# EAGLE design growPi_v2.1 (EAGLE 8.6.0)
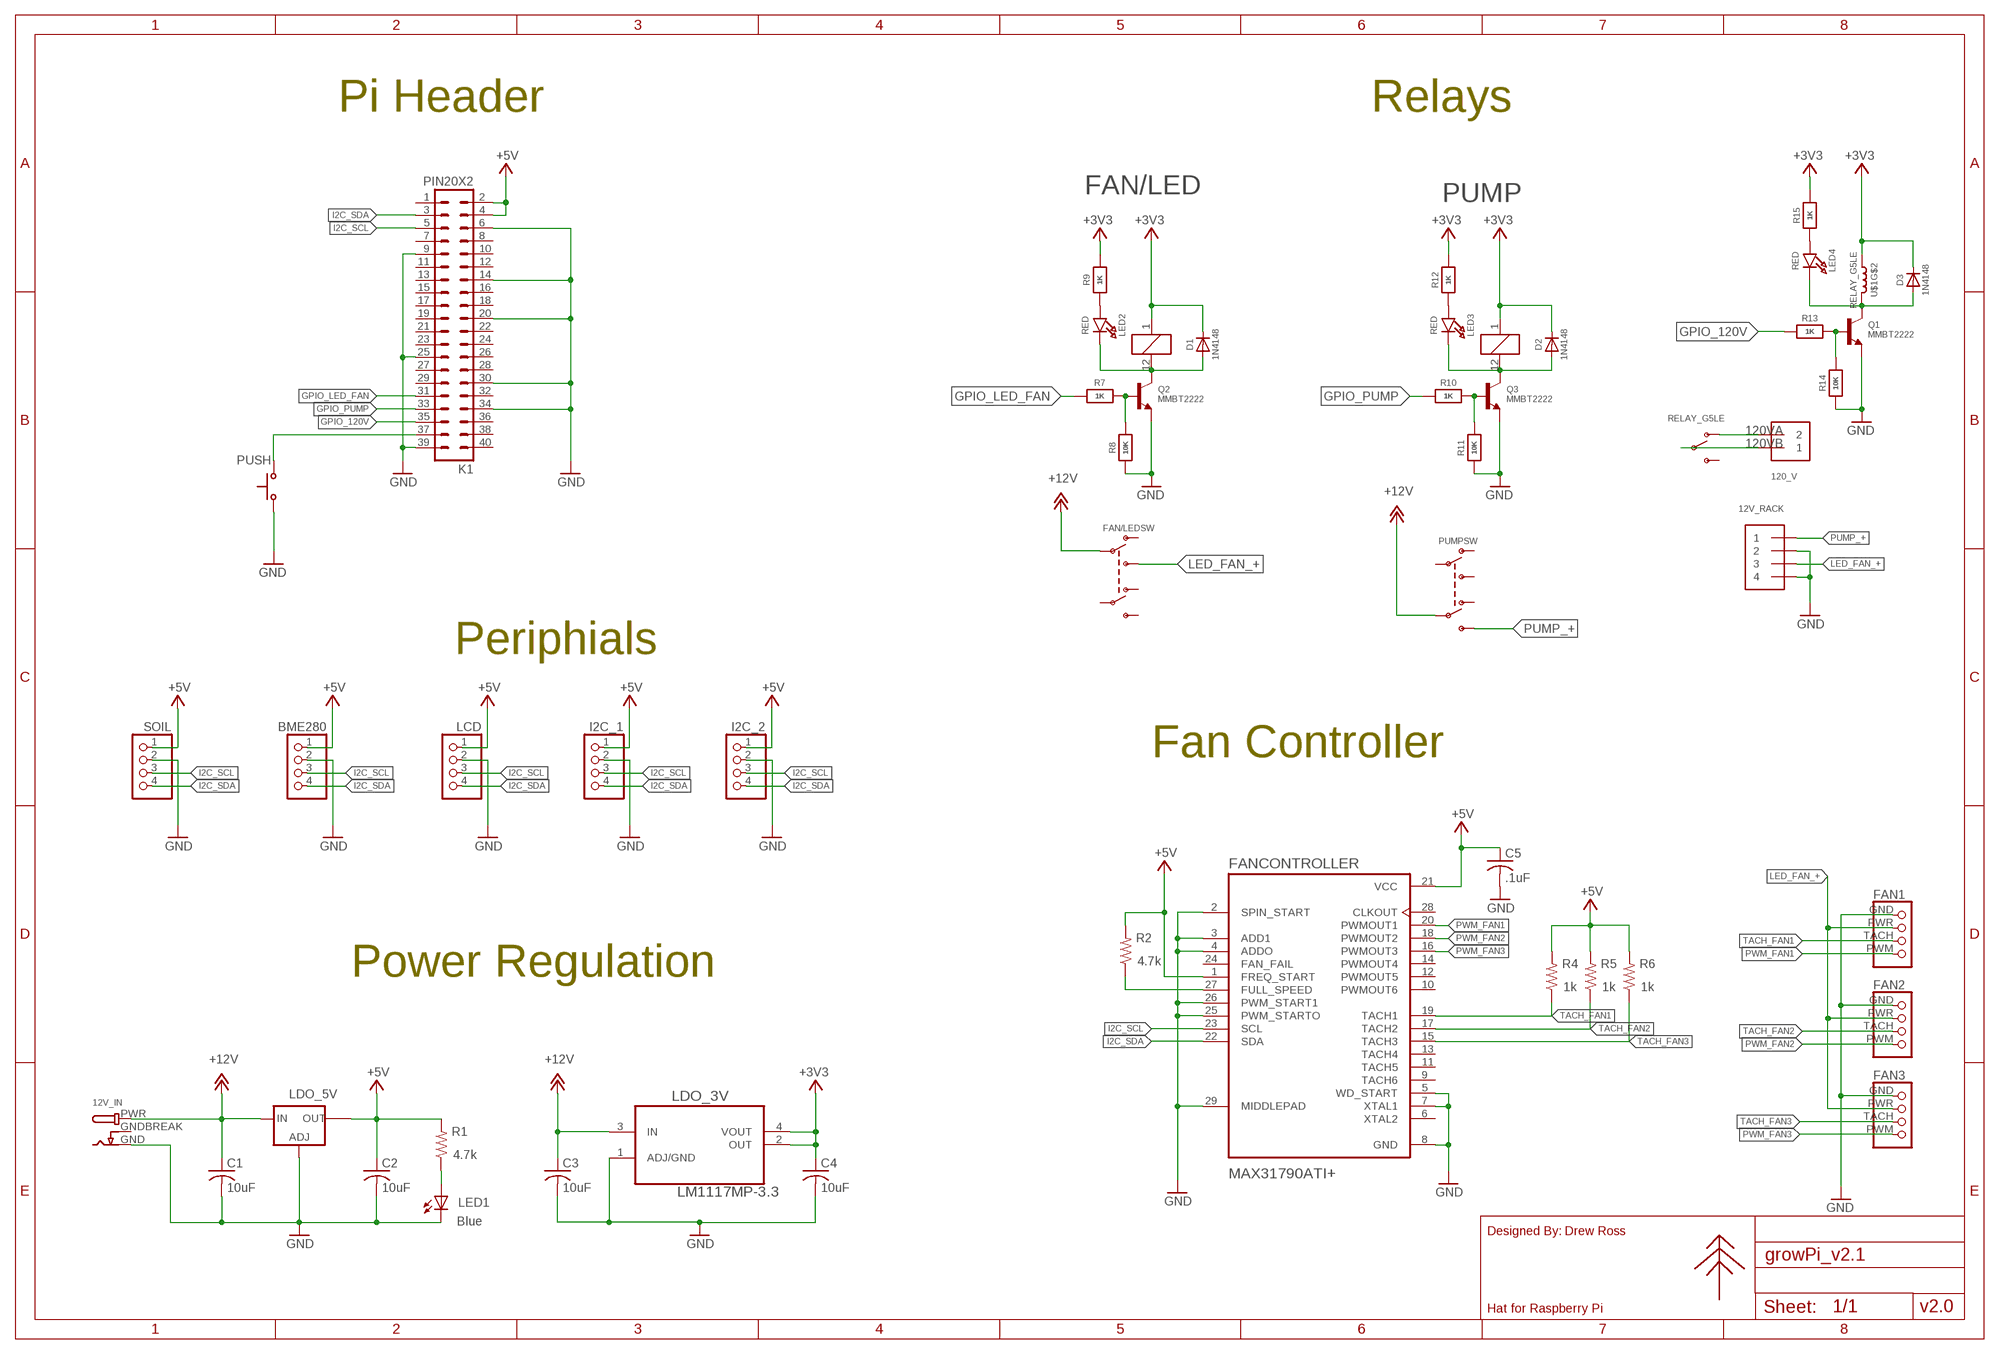
[diagram p0: schematic, sheet 1]

## Parts
12V_IN  DCBARRELSMT_CORRECT  [DCJACK_2MM_SMT]
12V_RACK  TERMBLOCK_1X4-5.0MM  [TERMBLOCK_1X4-5.0MM]
120_V  TERMBLOCK_1X2-5.0MM  [TERMBLOCK_1X2-5.0MM]
BME280  PINHD-1X4  [1X04]
C1  10uF  C-USC0603  [C0603]
C2  10uF  C-USC0603  [C0603]
C3  10uF  C-USC0603  [C0603]
C4  10uF  C-USC0603  [C0603]
C5  .1uF  C-USC0603  [C0603]
D1  1N4148  DIODESOD-323  [SOD-323]
D2  1N4148  DIODESOD-323  [SOD-323]
D3  1N4148  DIODESOD-323  [SOD-323]
FAN1  4PIN-MOLEX-FAN  [4PIN-FAN-HEADER]
FAN2  4PIN-MOLEX-FAN  [4PIN-FAN-HEADER]
FAN3  4PIN-MOLEX-FAN  [4PIN-FAN-HEADER]
FAN/LED  RELAY_NONLATCHING-EE2NUH  [RELAY_EE2_NOLATCH]
FANCONTROLLER  MAX31790ATI+  [QFN40P400X400X80-29N]
I2C_1  PINHD-1X4  [1X04]
I2C_2  PINHD-1X4  [1X04]
K1  PIN20X2  [PIN_20X2]
LCD  PINHD-1X4  [1X04]
LDO_3V  LM1117MP-3.3  [SOT230P696X180-4N]
LDO_5V  LM1084IS  [TO263]
LED1  Blue  LEDCHIPLED_0603  [CHIPLED_0603]
LED2  RED  LED0603_NOOUTLINE  [CHIPLED_0603_NOOUTLINE]
LED3  RED  LED0603_NOOUTLINE  [CHIPLED_0603_NOOUTLINE]
LED4  RED  LED0603_NOOUTLINE  [CHIPLED_0603_NOOUTLINE]
PLANTLOGO  PLANTLOGO  [PLANT]
PUMP  RELAY_NONLATCHING-EE2NUH  [RELAY_EE2_NOLATCH]
PUSH  PTS645SSMTR  [PTS645-SMD]
Q1  MMBT2222  TRANSISTOR_NPN  [SOT23-R]
Q2  MMBT2222  TRANSISTOR_NPN  [SOT23-R]
Q3  MMBT2222  TRANSISTOR_NPN  [SOT23-R]
R1  4.7k  R-US_R0603  [R0603]
R2  4.7k  R-US_R0603  [R0603]
R4  1k  R-US_R0603  [R0603]
R5  1k  R-US_R0603  [R0603]
R6  1k  R-US_R0603  [R0603]
R7  1K  RESISTOR_0603_NOOUT  [0603-NO]
R8  10K  RESISTOR_0603_NOOUT  [0603-NO]
R9  1K  RESISTOR_0603_NOOUT  [0603-NO]
R10  1K  RESISTOR_0603_NOOUT  [0603-NO]
R11  10K  RESISTOR_0603_NOOUT  [0603-NO]
R12  1K  RESISTOR_0603_NOOUT  [0603-NO]
R13  1K  RESISTOR_0603_NOOUT  [0603-NO]
R14  10K  RESISTOR_0603_NOOUT  [0603-NO]
R15  1K  RESISTOR_0603_NOOUT  [0603-NO]
SOIL  PINHD-1X4  [1X04]
U$1  RELAY_G5LE  [RELAY_G5LE-1]

## Nets
120VA [HV]: 120_V.2 U$1.3(O)
120VB [HV]: 120_V.1 U$1.1(P)
+3V3: C4.1 D1.C D2.C D3.C FAN/LED.1 LDO_3V.2(OUT) LDO_3V.4(VOUT) PUMP.1 R9.2 R12.2 R15.2 U$1.2
+5V: BME280.1 C2.1 C5.1 FANCONTROLLER.1(FREQ_START) FANCONTROLLER.21(VCC) I2C_1.1 I2C_2.1 K1.2 K1.4 LCD.1 LDO_5V.2(OUT) R1.2 R2.2 R4.2 R5.2 R6.2 SOIL.1
+12V: 12V_IN.PWR C1.1 C3.1 FAN/LED.9(SW:P1) LDO_3V.3(IN) LDO_5V.3(IN) PUMP.4(SW:P2)
GND: 12V_IN.GND 12V_RACK.2 12V_RACK.4 BME280.2 C1.2 C2.2 C3.2 C4.2 C5.2 FAN1.GND FAN2.GND FAN3.GND FANCONTROLLER.2(SPIN_START) FANCONTROLLER.3(ADD1) FANCONTROLLER.4(ADDO) FANCONTROLLER.5(WD_START) FANCONTROLLER.7(XTAL1) FANCONTROLLER.8(GND) FANCONTROLLER.25(PWM_STARTO) FANCONTROLLER.26(PWM_START1) FANCONTROLLER.29(MIDDLEPAD) I2C_1.2 I2C_2.2 K1.6 K1.9 K1.14 K1.20 K1.25 K1.30 K1.34 K1.39 LCD.2 LDO_3V.1(ADJ/GND) LDO_5V.1(ADJ) LED1.C PUSH.1(P) PUSH.2(P) Q1.2(E) Q2.2(E) Q3.2(E) R8.1 R11.1 R14.1 SOIL.2
GPIO_120V: K1.35 R13.1
GPIO_LED_FAN: K1.31 R7.1
GPIO_PUMP: K1.33 R10.1
I2C_SCL: BME280.3 FANCONTROLLER.23(SCL) I2C_1.3 I2C_2.3 K1.5 LCD.3 SOIL.3
I2C_SDA: BME280.4 FANCONTROLLER.22(SDA) I2C_1.4 I2C_2.4 K1.3 LCD.4 SOIL.4
LED_FAN_+: 12V_RACK.3 FAN1.PWR FAN2.PWR FAN3.PWR FAN/LED.8(SW:S1)
N$1: FANCONTROLLER.27(FULL_SPEED) R2.1
N$2: D1.A FAN/LED.12 LED2.C Q2.3(C)
N$3: Q2.1(B) R7.2 R8.2
N$6: LED2.A R9.1
N$7: D2.A LED3.C PUMP.12 Q3.3(C)
N$8: Q3.1(B) R10.2 R11.2
N$9: D3.A LED4.C Q1.3(C) U$1.5
N$10: LED3.A R12.1
N$11: LED1.A R1.1
N$12: K1.37 PUSH.3(S) PUSH.4(S)
N$22: Q1.1(B) R13.2 R14.2
N$26: LED4.A R15.1
PUMP_+: 12V_RACK.1 PUMP.5(SW:S2)
PWM_FAN1: FAN1.PWM FANCONTROLLER.20(PWMOUT1)
PWM_FAN2: FAN2.PWM FANCONTROLLER.18(PWMOUT2)
PWM_FAN3: FAN3.PWM FANCONTROLLER.16(PWMOUT3)
TACH_FAN1: FAN1.TACH FANCONTROLLER.19(TACH1) R4.1
TACH_FAN2: FAN2.TACH FANCONTROLLER.17(TACH2) R5.1
TACH_FAN3: FAN3.TACH FANCONTROLLER.15(TACH3) R6.1
Unconnected: FAN/LED.3(SW:O2) FAN/LED.4(SW:P2) FAN/LED.5(SW:S2) FAN/LED.10(SW:O1) FANCONTROLLER.6(XTAL2) FANCONTROLLER.9(TACH6) FANCONTROLLER.10(PWMOUT6) FANCONTROLLER.11(TACH5) FANCONTROLLER.12(PWMOUT5) FANCONTROLLER.13(TACH4) FANCONTROLLER.14(PWMOUT4) FANCONTROLLER.24(FAN_FAIL) FANCONTROLLER.28(CLKOUT) K1.1 K1.7 K1.8 K1.10 K1.11 K1.12 K1.13 K1.15 K1.16 K1.17 K1.18 K1.19 K1.21 K1.22 K1.23 K1.24 K1.26 K1.27 K1.28 K1.29 K1.32 K1.36 K1.38 K1.40 LDO_5V.4(OUT4) PUMP.3(SW:O2) PUMP.8(SW:S1) PUMP.9(SW:P1) PUMP.10(SW:O1) U$1.4(S)

## Notes on the sheet
- Pi Header | Relays
- Periphials
- Fan Controller
- Power Regulation
- Designed By: | Drew Ross
- Hat for Raspberry Pi | v2.0

## Power pins joined to a net without a drawn wire
GNDBREAK: 12V_IN.GNDBREAK

## Library data of the parts
12V_IN = microbuilder:DCBARREL: DC Barrel Jack DCJACK_1.3MM_PTH - Through Hole 1.3mm Jack (4UConnector: 05536) DCJACK_2MM_PTH - Through Hole 2.0/2.1 Jack (4UConnector: 05537) DCJACK_2MM_SMT - SMT 2.0/2.1mm Jack(4UConnector: 03267)
12V_RACK = OST_TermBlocks:TERMBLOCK_1X4-5.0MM: 5mm Terminal block http://www.ladyada.net/library/pcb/eaglelibrary.html
120_V = OST_TermBlocks:TERMBLOCK_1X2-5.0MM: 5mm Terminal block http://www.ladyada.net/library/pcb/eaglelibrary.html
BME280 I2C_1 I2C_2 LCD SOIL = pinhead:PINHD-1X4: PIN HEADER
C1-C5 = adafruit:C-US: CAPACITOR, American symbol
D1-D3 = microbuilder:DIODE: Diode SMA Model Volts Amps Type Vf Ir Digikey # Notes SSA34-E3 40V 3A Schottky 480mV @ 3A 200uA @ 40V SSA34-E3/61TGITR-ND CDBA120-G 20V 1A Schottky 500mV @ 1A 500uA @ 20V 641-1014-6-ND REEL MBRA210 10V 2A Schottky 350mV @ 2A 700uA @ 10V MBRA210LT3 SOD-123 Model Volts Amps Type Vf Ir Order # Notes BAT54T1G 30V 200mA Schottky 800mV @ 200mA 2uA @ 25V BAT54T1GOSTR-ND B0530W 30V 500mA Schottky 430mV @ 500mA 130uA @ 30V B0530W-FDICT-ND REEL MBR120 20V 1A Schottky 340mV @ 1A MBR120VLSFT1GOSCT-ND SOD-323 Model Volts Amps Type Vf Ir Order # Notes PMEG2005EJ 20V 500mA Schottky 355mV @ 500mA 568-4110-1-ND ZLLS410 10V 570mA Schottky 380mV @ 570mA ZLLS410CT-ND 1N4148WS 75V 150mA Silicon/Simple 1V 1N4148WSFSCT-ND REEL SOD-523 Model Volts Amps Type Vf Ir Order # Notes BAT54XV2 30V 200mA Schottky 0.8V @ 100mA BAT54XV2CT-ND TB751S 30V 30mA Schottky RB751S-40TE61CT-ND SOT23-R/W (R = Solder Paste/Reflow Ovens, W = Hand-Soldering) Model Volts Amps Type Vf Ir Order # Notes BAT54FILM 40V 300mA Schottky 497-7162-1-ND POWERDI-5 Model Volts Amps Type Vf Ir Order # Notes PDS560 60V 5A Schottky 670mV @ 5A 150uA @ 60V PDS560DICT-ND
FAN1-FAN3 = 4pinMolexFan:4PIN-MOLEX-FAN: PIN HEADER
FAN/LED PUMP = microbuilder:RELAY_NONLATCHING
FANCONTROLLER = MAX31790ATI_:MAX31790ATI+: None; AVAILABILITY: Warning; DESCRIPTION: IC MOTOR CONTROLLER I2C 28TQFN; MF: Maxim Integrated; MP: MAX31790ATI+; PACKAGE: TQFN-28 Maxim Integrated; PRICE: 2.83 USD
K1 = FLYFISH:PIN20X2
LDO_3V = LM1117MP-3.3:LM1117MP-3.3: Linear regulators; AVAILABILITY: Good; DESCRIPTION: LDO Regulator Pos 3.3V 0.8A 4-Pin(3+Tab) SOT-223 T/R; MF: Texas Instruments; MP: LM1117MP-3.3; PACKAGE: SOT-223 Texas Instruments; PRICE: 0.62 USD
LDO_5V = v-reg:LM1084IS: VOLTAGE REGULATOR
LED1 = adafruit:LED: LED
LED2-LED4 = microbuilder:LED: LED
PLANTLOGO = plant_logo:PLANTLOGO
PUSH = switch-ck:PTS645S???SMTR: TACT SWITCH
Q1-Q3 = microbuilder:TRANSISTOR_NPN: NPN Transistor Transistor (NPN) 500mA 45V - BC817 [Digikey: 568-1631-1-ND] Transistor (NPN) 500mA 45V - BC817,215 [Mouser: 771-BC817-T/R] SOT23-R - SOT23 footprint optimised for use with solder paste and reflow ovens. SOT23-W - SOT23 footprint optimised for hand-soldering (larger pads).
R1 R2 R4-R6 = adafruit:R-US_: RESISTOR, American symbol
R7-R15 = microbuilder:RESISTOR: Resistors For new designs, use the packages preceded by an '_' character since they are more reliable: The following footprints should be used on most boards: _0402 - Standard footprint for regular board layouts _0603 - Standard footprint for regular board layouts _0805 - Standard footprint for regular board layouts _1206 - Standard footprint for regular board layouts For extremely tight-pitch boards where space is at a premium, the following 'micro-pitch' footprints can be used (smaller pads, no silkscreen outline, etc.): _0402MP - Micro-pitch footprint for very dense/compact boards _0603MP - Micro-pitch footprint for very dense/compact boards _0805MP - Micro-pitch footprint for very dense/compact boards _1206MP - Micro-pitch footprint for very dense/compact boards
U$1 = microbuilder:RELAY_G5LE

## Net classes
1 HV: width 0.406 mm, drill 0.381 mm, clearance 1.016 mm

## Board
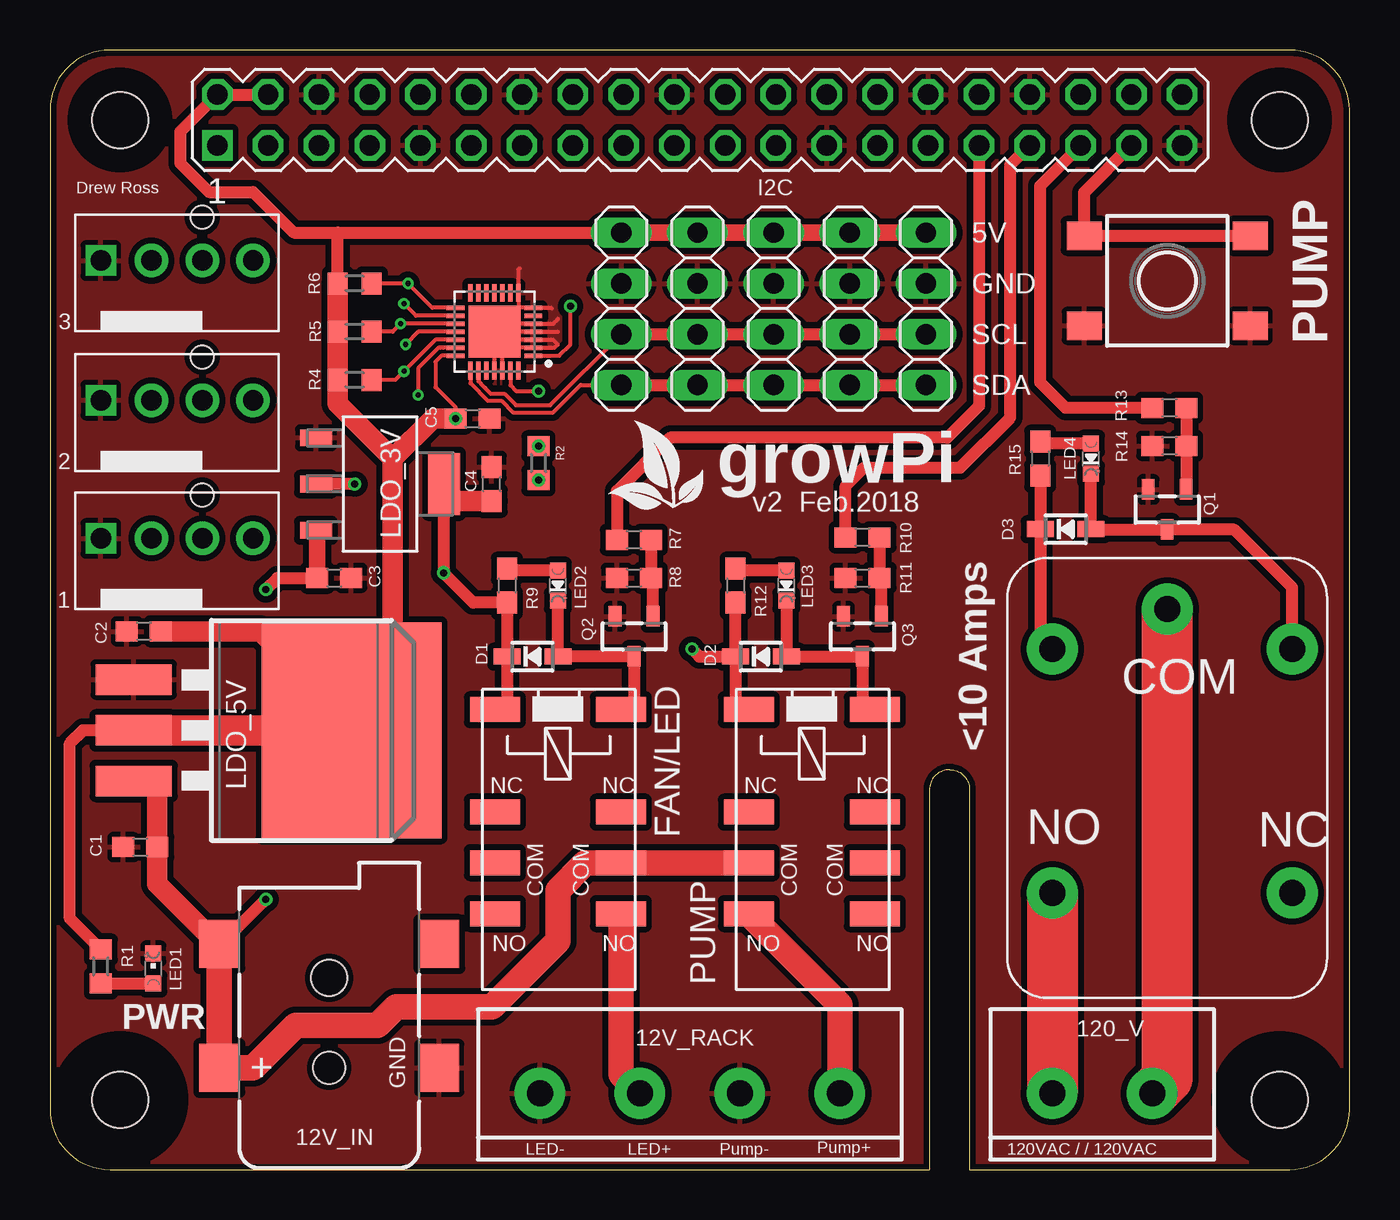
[diagram p1: board, top side]
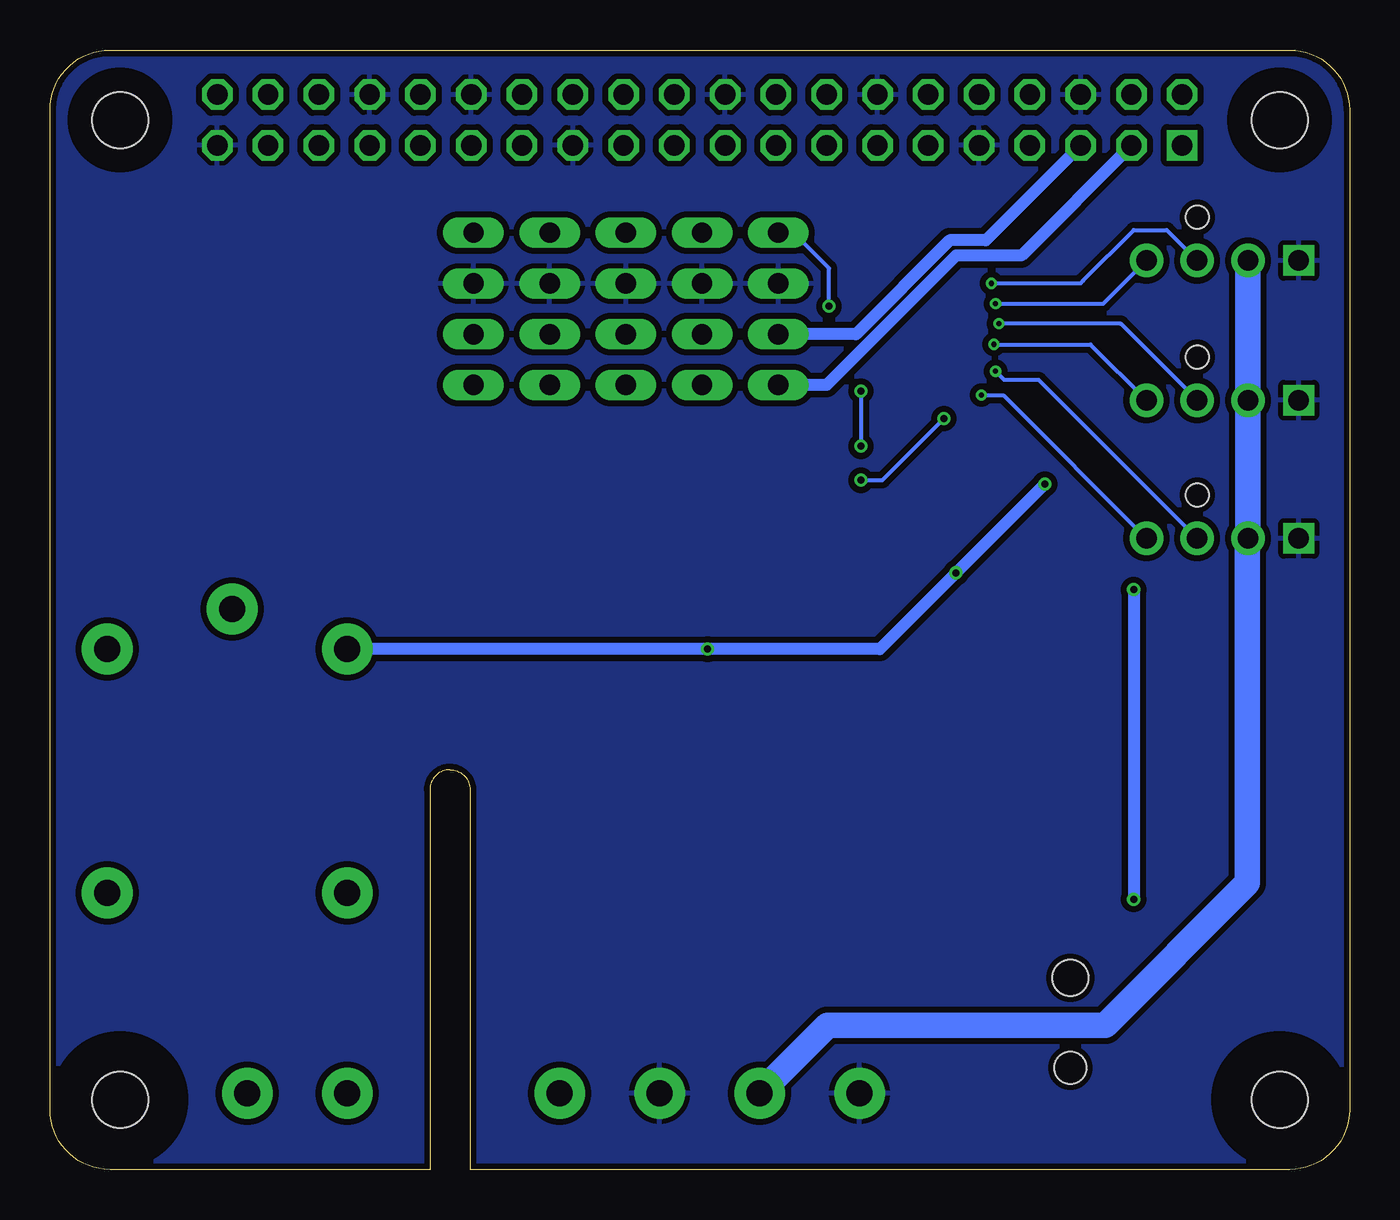
[diagram p2: board, bottom side, seen from below]

Size 65 x 56 mm. Coordinates in mm from the lower left corner, seen from the top.
Outline: 45,20 arc90 43.99,19
Outline: 43.99,19 43.99,0 3,0 arc-90 0,3 0,53 arc-90 3,56 62,56 arc-90 65,53 65,3 arc-90 62,0 46,0 46,19 arc90 45,20
Outline: 45,20 arc90 43.99,19
Copper layers (1*16): Top 0.035mm / dielectric 1.5mm / Bottom 0.035mm
Design rules "ITEADstudio_DRC *": minimum track width 6mil, minimum drill 10mil, track to track 6mil, track to pad 6mil, pad to pad 6mil, via to via 5mil, smd to smd 0mil, copper to edge 10mil, drill to drill 10mil, minimum pad ring 10mil, minimum via ring 6mil, stop-mask expansion 2mil, vias tented up to drill 100mil, thermal gap 10mil
Holes 2.8 mm at 3.5,3.5 3.5,52.5 61.5,52.5 61.5,3.5
tRestrict: area 2.7,51.7 to 4.3,53.3; area 60.7,51.7 to 62.3,53.3; area 60,1.9 to 63,5; area 1.9,1.9 to 5,5
bRestrict: area 1.9,1.9 to 5,5; area 2.7,51.7 to 4.3,53.3; area 60,1.9 to 63,5; area 60.7,51.7 to 62.3,53.3

### Footprints (pad centres in the part's own frame; a part is rotated, then mirrored left to right if it is on the bottom)
DCJACK_2MM_SMT = smd 2.4 x 2: GND 0,-5.5; GNDBREAK 6.2,-5.5; PWR 0,5.5; PWR2 6.2,5.5 | hole 1.6: 0,0 | hole 1.8: 4.5,0
TERMBLOCK_1X4-5.0MM = drill 1.3 pad 2.54: 1 7.5,0; 2 2.5,0; 3 -2.5,0; 4 -7.5,0
TERMBLOCK_1X2-5.0MM = drill 1.3 pad 2.54: 1 2.5,0; 2 -2.5,0
1X04 = drill 1.016 long: 1 -3.81,0; 2 -1.27,0; 3 1.27,0; 4 3.81,0
C0603 = smd 1.1 x 1: 1 -0.85,0; 2 0.85,0
SOD-323 = smd 1.35 x 0.8: A 1.27,0; C -1.27,0
4PIN-FAN-HEADER = drill 1.02 square: GND 5.08,0 | drill 1.02 pad 1.676: PWM -2.54,0; PWR 2.54,0; TACH 0,0 | hole 1.15: 0,-2.16
RELAY_EE2_NOLATCH = smd 1.25 x 2.5: 1 -6.5,-3.15; 3 -1.37,-3.15; 4 1.17,-3.15; 5 3.71,-3.15; 8 3.71,3.15; 9 1.17,3.15; 10 -1.37,3.15; 12 -6.5,3.15
QFN40P400X400X80-29N = smd 0.89 x 0.22: 1 -1.945,1.2; 2 -1.945,0.8; 3 -1.945,0.4; 4 -1.945,0; 5 -1.945,-0.4; 6 -1.945,-0.8; 7 -1.945,-1.2; 15 1.945,-1.2; 16 1.945,-0.8; 17 1.945,-0.4; 18 1.945,0; 19 1.945,0.4; 20 1.945,0.8; 21 1.945,1.2 | smd 0.22 x 0.89: 8 -1.2,-1.945; 9 -0.8,-1.945; 10 -0.4,-1.945; 11 0,-1.945; 12 0.4,-1.945; 13 0.8,-1.945; 14 1.2,-1.945; 22 1.2,1.945; 23 0.8,1.945; 24 0.4,1.945; 25 0,1.945; 26 -0.4,1.945; 27 -0.8,1.945; 28 -1.2,1.945 | smd 2.6 x 2.6: 29 0,0
PIN_20X2 = drill 1.016 square: 1 -24.13,-1.27 | drill 1.016 octagon: 2 -24.13,1.27; 3 -21.59,-1.27; 4 -21.59,1.27; 5 -19.05,-1.27; 6 -19.05,1.27; 7 -16.51,-1.27; 8 -16.51,1.27; 9 -13.97,-1.27; 10 -13.97,1.27; 11 -11.43,-1.27; 12 -11.43,1.27; 13 -8.89,-1.27; 14 -8.89,1.27; 15 -6.35,-1.27; 16 -6.35,1.27; 17 -3.81,-1.27; 18 -3.81,1.27; 19 -1.27,-1.27; 20 -1.27,1.27; 21 1.27,-1.27; 22 1.27,1.27; 23 3.81,-1.27; 24 3.81,1.27; 25 6.35,-1.27; 26 6.35,1.27; 27 8.89,-1.27; 28 8.89,1.27; 29 11.43,-1.27; 30 11.43,1.27; 31 13.97,-1.27; 32 13.97,1.27; 33 16.51,-1.27; 34 16.51,1.27; 35 19.05,-1.27; 36 19.05,1.27; 37 21.59,-1.27; 38 21.59,1.27; 39 24.13,-1.27; 40 24.13,1.27
SOT230P696X180-4N = smd 1.6 x 0.838: 1 -3.2,2.311; 2 -3.2,0; 3 -3.2,-2.311 | smd 1.6 x 3.099: 4 3.2,0
TO263 = smd 1.524 x 3.81: 1 -2.54,-8.255; 2 0,-8.255; 3 2.54,-8.255 | smd 10.8 x 9: 4 0,2.635
CHIPLED_0603 = smd 0.8 x 0.8: A 0,-0.75; C 0,0.75
CHIPLED_0603_NOOUTLINE = smd 0.8 x 0.8: A 0,-0.75; C 0,0.75
PTS645-SMD = smd 1.75 x 1.4: 1 -4.15,2.25; 2 4.15,2.25; 3 -4.15,-2.25; 4 4.15,-2.25
SOT23-R = smd 0.635 x 1.016: 1 -0.95,-1; 2 0.95,-1; 3 0,1
R0603 = smd 1 x 1.1: 1 -0.85,0; 2 0.85,0
0603-NO = smd 1.1 x 1: 1 -0.85,0; 2 0.85,0
RELAY_G5LE-1 = drill 1.3 pad 2.54: 1 -8.35,0; 2 -6.35,-5.75; 3 5.85,-5.75; 4 5.85,6.25; 5 -6.35,6.25

### Placement (x,y rotation side)
12V_IN  13.97,5.08 90 top
12V_RACK  32,3.81 0 top
120_V  52.63,3.81 0 top
BME280  32.38,43.05 270 top
C1  4.52,16.13 180 top
C2  4.7,26.92 180 top
C3  14.22,29.59 0 top
C4  22.1,34.29 90 top
C5  21.13,37.57 0 top
D1  24.13,25.65 0 top
D2  35.56,25.65 0 top
D3  50.8,32.03 0 top
FAN1  7.62,31.57 180 top
FAN2  7.62,38.48 180 top
FAN3  7.62,45.47 180 top
FAN/LED  25.4,16.51 270 top
FANCONTROLLER  22.23,41.91 180 top
I2C_1  43.81,43.05 270 top
I2C_2  40.01,43.05 270 top
K1  32.5,52.5 0 top
LCD  36.2,43.05 270 top
LDO_3V  16.51,34.29 0 top
LDO_5V  12.45,21.97 270 top
LED1  5.17,10.06 0 top
LED2  25.4,29.21 180 top
LED3  36.83,29.21 180 top
LED4  52.07,35.56 180 top
PLANTLOGO  27.94,33.02 0 top
PUMP  38.1,16.51 270 top
PUSH  PTS645S??SMTR  [PTS645-SMD]  55.88,44.45 180 top
Q1  55.88,33.02 180 top
Q2  29.21,26.67 180 top
Q3  40.64,26.67 180 top
R1  2.54,10.16 90 top
R2  24.43,35.33 270 top
R4  15.24,39.5 180 top
R5  15.24,41.91 180 top
R6  15.24,44.32 180 top
R7  29.21,31.5 0 top
R8  29.21,29.59 0 top
R9  22.86,29.21 270 top
R10  40.64,31.62 0 top
R11  40.64,29.59 0 top
R12  34.29,29.21 270 top
R13  55.98,38.1 0 top
R14  55.98,36.2 0 top
R15  49.53,35.56 270 top
SOIL  28.57,43.05 270 top
U$1  55.88,19.68 270 top

### Tracks (layer width: path | path; a pad name or v marks a point on that pad's centre or on a via)
120VA
  Top 2.54: U$1.3 120_V.2
120VB
  Top 2.54: 120_V.1 55.88,4.56 U$1.1
+3V3  (via drill 0.36, 0.36 pad 0.64)
  Top 0.254: 21.66,23.01 FAN/LED.1 22.89,23.01 | 34.34,23.01 PUMP.1 | R12.2 33.99,28.26
  Top 0.61: FAN/LED.1 22.86,23.01 D1.C R9.2 21.17,28.36 v19.68,29.84 19.68,33.66 19.68,34.27 LDO_3V.4 19.84,34.42 | D2.C 34.29,23.01 PUMP.1 | D2.C R12.2 | v15.24,34.29 LDO_3V.2 | U$1.2 49.53,26.64 D3.C R15.2 | v32.11,26.04 32.49,25.65 D2.C
  Top 1.016: C4.1 19.9,33.44 19.68,33.66
  Bottom 0.61: v15.24,34.29 v19.68,29.84 23.5,26.04 v32.11,26.04 U$1.2
+5V  (via drill 0.35)
  Top 0.203: FANCONTROLLER.21 19.59,40.71 19.28,40.41 19.28,39.14 20.28,38.14 C5.1 | FANCONTROLLER.1 25.47,40.71 26.04,41.27 v26.04,43.18
  Top 0.229: 14.46,40.71 14.39,40.64
  Top 0.61: K1.4 K1.2 6.53,51.93 6.53,50.32 7.95,48.9 10.16,48.9 12.19,46.86 14.4,46.86 | R1.2 0.99,12.56 0.99,21.31 1.65,21.97 LDO_5V.2 | 14.4,46.86 SOIL.1 | R6.2 14.39,46.85 14.4,46.86
  Top 0.813: SOIL.1 BME280.1 LCD.1 I2C_2.1 I2C_1.1 | 17.14,24.13 13.34,24.13
  Top 1.016: C2.1 10.54,26.92 13.34,24.13 11.18,21.97 | R6.2 R5.2 14.39,40.64 R4.2 14.39,38.31 17.14,35.56 | 17.14,35.56 17.14,24.13 | 17.14,35.56 19.15,37.57 C5.1
  Top 1.524: LDO_5V.2 11.18,21.97
  Bottom 0.203: v26.04,43.18 26.04,45.09 27.94,46.99 28.07,46.86 SOIL.1 | R2.2 23.37,34.48 C5.1
  other vias: 24.43,34.48 20.28,37.57
+12V  (via drill 0.36 pad 0.64)
  Top 0.61: FAN/LED.9 28.45,15.24 | 8.47,11.49 8.47,11.19 v10.79,13.51 | v10.79,29.01 11.38,29.59 C3.1
  Top 0.813: C3.1 13.37,31.91 LDO_3V.3
  Top 1.016: 8.47,11.19 5.37,14.29 C1.1 5.37,19.39 5.08,19.68 4.83,19.43 LDO_5V.3
  Top 1.27: 8.51,11.23 8.47,11.19 12V_IN.PWR 10.16,5.08 12.29,7.21 16.39,7.21 17.32,8.14 22.11,8.14 25.4,11.43 25.4,13.97 26.77,15.34 FAN/LED.9 PUMP.4
  Bottom 0.61: v10.79,29.01 v10.79,13.51
GND
  Top 0.203: 25.4,42.55 25.16,42.31 FANCONTROLLER.5 22.46,42.31 22.23,42.55 22.79,43.11 FANCONTROLLER.7 25.06,43.11 25.09,43.08 | 25.4,41.91 FANCONTROLLER.4 22.86,41.91 | FANCONTROLLER.26 22.62,41.04 22.7,41.11 | 22.7,41.11 22.86,41.27 | FANCONTROLLER.25 22.23,40.64 FANCONTROLLER.29 | 22.7,41.11 FANCONTROLLER.2 25.23,41.11 25.4,41.27 25.16,41.51 FANCONTROLLER.3 22.62,41.51 FANCONTROLLER.29 | 22.86,41.91 FANCONTROLLER.29 | 22.86,41.91 23.43,42.48 FANCONTROLLER.8 23.43,45.02 23.5,45.09
  pour Bottom (isolate 0.305): 0,3 arc90 3,0 62,0 arc90 65,3 65,53 arc90 62,56 3,56 arc90 0,53 0,18.5
  pour Top (isolate 0.305): 0,3 arc90 3,0 62,0 arc90 65,3 65,53 arc90 62,56 3,56 arc90 0,53
GPIO_120V
  Top 0.61: R13.1 50.8,38.1 49.53,39.37 49.53,49.21 K1.35
GPIO_LED_FAN
  Top 0.61: R7.1 28.36,33.95 31.01,36.6 44.88,36.6 46.47,38.19 K1.31
GPIO_PUMP
  Top 0.61: R10.1 39.79,34.18 40.72,35.1 45.52,35.1 48.03,37.62 48.03,50.25 K1.33
I2C_SCL
  Top 0.203: FANCONTROLLER.23 21.43,39.43 21.54,39.32 21.77,39.09 22.05,38.81 22.73,38.81 23.31,38.23 25.02,38.23 SOIL.3
  Top 0.61: 13.45,50.9 K1.5 | SOIL.3 BME280.3 LCD.3 I2C_2.3 I2C_1.3
  Bottom 0.61: K1.5 18.2,46.48 20,46.48 24.7,41.78 SOIL.3
I2C_SDA
  Top 0.203: SOIL.4 26.54,39.24 25.17,37.87 23.16,37.87 22.58,38.46 21.9,38.46 21.02,39.33 FANCONTROLLER.22
  Top 0.61: 10.91,50.9 K1.3 | SOIL.4 BME280.4 LCD.4 I2C_2.4 I2C_1.4
  Bottom 0.61: 27.43,39.24 SOIL.4 26.16,39.24 19.68,45.72 16.42,45.72 K1.3
LED_FAN_+
  Top 1.27: 12V_RACK.3 28.55,4.76 28.55,9.53 FAN/LED.8
  Bottom 0.61: 5.11,31.55 FAN1.PWR
  Bottom 1.27: FAN1.PWR FAN2.PWR FAN3.PWR | 12V_RACK.3 26.1,7.21 16.51,7.21 12.22,7.21 5.11,14.33 5.11,31.55
N$1  (via drill 0.35)
  Top 0.203: FANCONTROLLER.27 23.02,39.23 23.32,38.94 v24.43,38.94
  Bottom 0.203: v24.43,38.94 R2.1
  other vias: 24.43,36.18
N$2
  Top 0.61: FAN/LED.12 29.21,23.01 Q2.3 29.19,25.65 D1.A LED2.C
N$3
  Top 0.61: Q2.1 30.16,29.49 R8.2 R7.2
N$6
  Top 0.61: LED2.A 22.96,29.96 R9.1
N$7
  Top 0.61: 40.89,23.37 PUMP.12 40.64,23.01 Q3.3 40.62,25.65 D2.A LED3.C
N$8
  Top 0.61: Q3.1 41.59,29.49 R11.2 R10.2
N$9
  Top 0.61: LED4.C D3.A Q1.3 55.9,32 59.23,32 62.13,29.11 U$1.5
N$10
  Top 0.61: LED3.A 34.39,29.96 R12.1
N$11
  Top 0.61: R1.1 | R1.1 LED1.A
N$12
  Top 0.61: K1.37 51.73,48.87 PUSH.4 PUSH.3
N$22
  Top 0.61: R13.2 R14.2 Q1.1
N$26
  Top 0.61: LED4.A 49.63,36.31 R15.1
PUMP_+
  Top 1.27: 12V_RACK.1 39.5,8.25 PUMP.5
PWM_FAN1  (via drill 0.25)
  Top 0.203: FANCONTROLLER.20 19.68,41.11 19.52,41.11 19.44,41.11 18.41,40.08 v18.41,38.73
  Bottom 0.203: v18.41,38.73 17.32,38.73 FAN1.PWM
PWM_FAN2  (via drill 0.25)
  Top 0.203: FANCONTROLLER.18 18.41,41.91 v17.78,41.27
  Bottom 0.203: v17.78,41.27 12.95,41.27 FAN2.PWM
PWM_FAN3  (via drill 0.25)
  Top 0.203: FANCONTROLLER.16 18.3,42.71 v17.7,43.31
  Bottom 0.203: v17.7,43.31 12.32,43.31 FAN3.PWM
TACH_FAN1  (via drill 0.25)
  Top 0.203: FANCONTROLLER.19 19.29,41.51 v17.7,39.93 17.27,39.5 R4.1
  Bottom 0.203: FAN1.TACH 15.54,39.5 17.27,39.5 v17.7,39.93
TACH_FAN2  (via drill 0.25)
  Top 0.203: R5.1 17.14,41.91 v17.55,42.31 FANCONTROLLER.17
  Bottom 0.203: v17.55,42.31 11.45,42.31 FAN2.TACH
TACH_FAN3  (via drill 0.25)
  Top 0.203: FANCONTROLLER.15 19.12,43.11 v17.91,44.32 R6.1
  Bottom 0.203: FAN3.TACH 9.14,46.99 10.79,46.99 13.34,44.45 13.46,44.32 v17.91,44.32

### Text on the board
tPlace: 3 | 2 | 1 | COM | NO | NC
tNames: Drew Ross | I2C | 5V | GND | SCL | PUMP | SDA | growPi | v2 Feb.2018 | <10 Amps | PWR | LED- | LED+ | Pump- | Pump+ | 120VAC / / 120VAC